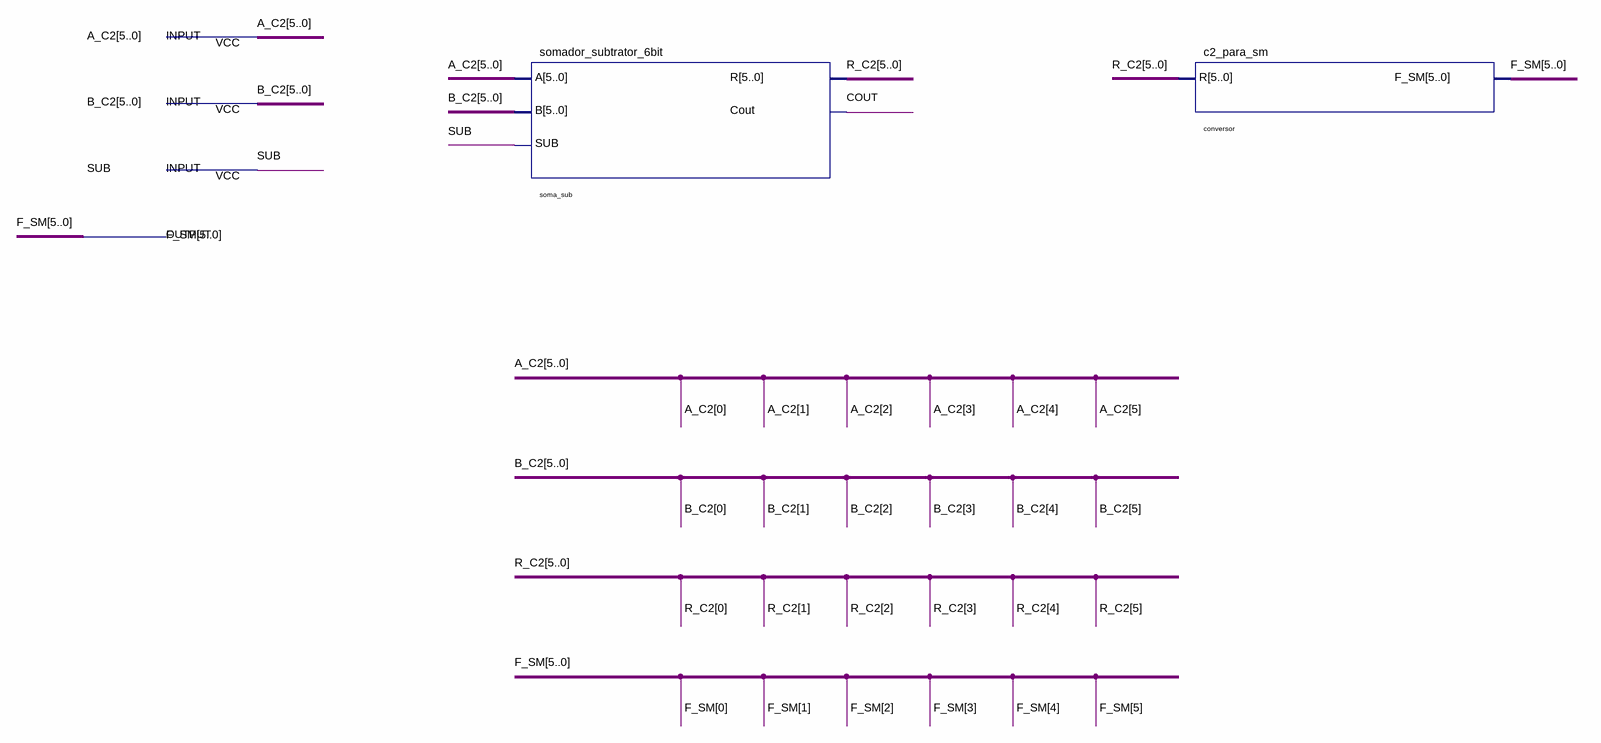
[diagram p0: schematic sheet]
// Quartus schematic modulo2_soma_sub.bdf as structural Verilog: 2 symbols, 4 pins
module modulo2_soma_sub (
  input  [5:0] A_C2,
  input  [5:0] B_C2,
  input  SUB,
  output [5:0] F_SM
);

  wire COUT;
  wire [5:0] R_C2;

  somador_subtrator_6bit soma_sub (.A(A_C2), .B(B_C2), .SUB(SUB), .R(R_C2), .Cout(COUT));
  c2_para_sm conversor (.R(R_C2), .F_SM(F_SM));
endmodule
